# Altium schematic sheet STM_mcu.SchDoc: STM MCU
size A; Date: 10.8.2026; Author: Matevz Sedmak; SheetNumber: 1; SheetTotal: 1
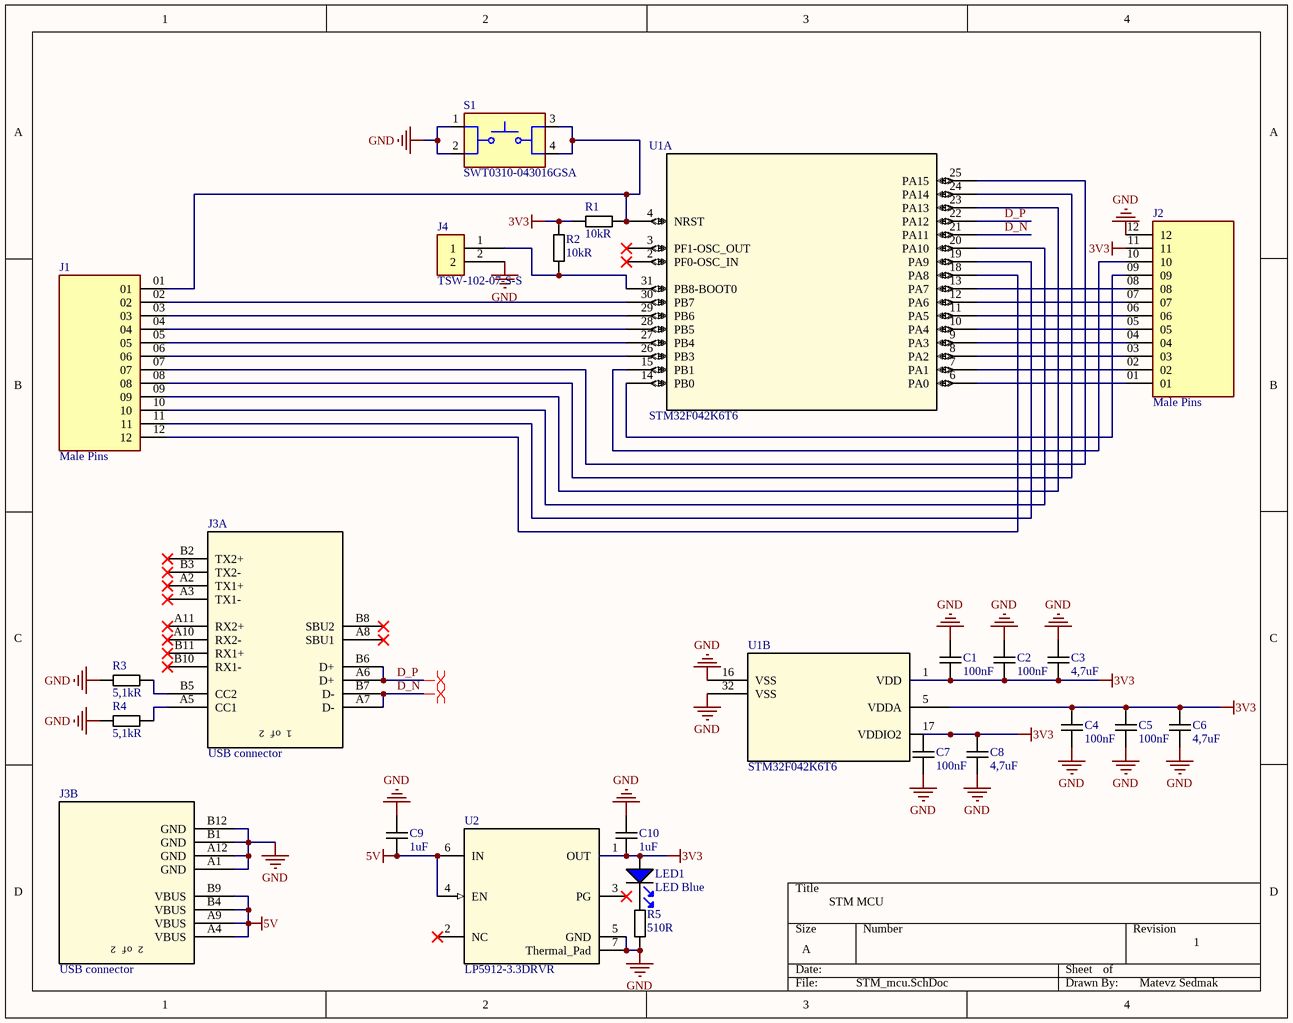
[diagram p0: STM_mcu.SchDoc]

## Parts
C1  100nF  [CAPACITOR_0402]
C2  100nF  [CAPACITOR_0402]
C3  4,7uF  [CAPACITOR_0603]
C4  100nF  [CAPACITOR_0402]
C5  100nF  [CAPACITOR_0402]
C6  4,7uF  [CAPACITOR_0603]
C7  100nF  [CAPACITOR_0402]
C8  4,7uF  [CAPACITOR_0603]
C9  1uF  [CAPACITOR_0603]
C10  1uF  [CAPACITOR_0603]
J1  Male Pins  [SAMTEC_TSW-112-07-L-S]
J2  Male Pins  [SAMTEC_TSW-112-07-L-S]
J3  USB connector  [USB_C_CONN_1054500101]  (parts A,B of 2)
J4  TSW-102-07-S-S  [SAMTEC_TSW-102-07-L-S]
LED1  LED Blue  [LED_0603]
R1  10kR  [RESISTOR_0402]
R2  10kR  [RESISTOR_0402]
R3  5,1kR  [RESISTOR_0402]
R4  5,1kR  [RESISTOR_0402]
R5  510R  [RESISTOR_0402]
S1  SWT0310-043016GSA  [SWT0310 - switch]
U1  STM32F042K6T6  [Quad32-STM32F042K6T6]  (parts A,B of 2)
U2  LP5912-3.3DRVR  [LP5912]

## Nets
3V3: C1.1 C2.1 C3.1 C4.1 C5.1 C6.1 C7.1 C8.1 C10.1 J2.11 LED1.2(A) R1.1(R1) R2.1(R1) U1.1(VDD) U1.5(VDDA) U1.17(VDDIO2) U2.1(OUT)
5V: C9.1 J3.A4(VBUS) J3.A9(VBUS) J3.B4(VBUS) J3.B9(VBUS) U2.4(EN) U2.6(IN)
GND: C1.2 C2.2 C3.2 C4.2 C5.2 C6.2 C7.2 C8.2 C9.2 C10.2 J2.12 J3.A1(GND) J3.A12(GND) J3.B1(GND) J3.B12(GND) J4.2 R3.1(R1) R4.1(R1) R5.1(R1) S1.1 S1.2 U1.16(VSS) U1.32(VSS) U2.5(GND) U2.7(Thermal_Pad)
D_N: J3.A7(D-) J3.B7(D-) U1.21(PA11)
D_P: J3.A6(D+) J3.B6(D+) U1.22(PA12)
NetJ1_01: J1.01 R1.2(R2) S1.3 S1.4 U1.4(NRST)
NetJ1_02: J1.02 U1.30(PB7)
NetJ1_03: J1.03 U1.29(PB6)
NetJ1_04: J1.04 U1.28(PB5)
NetJ1_05: J1.05 U1.27(PB4)
NetJ1_06: J1.06 U1.26(PB3)
NetJ1_07: J1.07 U1.25(PA15)
NetJ1_08: J1.08 U1.24(PA14)
NetJ1_09: J1.09 U1.23(PA13)
NetJ1_10: J1.10 U1.20(PA10)
NetJ1_11: J1.11 U1.19(PA9)
NetJ1_12: J1.12 U1.18(PA8)
NetJ2_01: J2.01 U1.6(PA0)
NetJ2_02: J2.02 U1.7(PA1)
NetJ2_03: J2.03 U1.8(PA2)
NetJ2_04: J2.04 U1.9(PA3)
NetJ2_05: J2.05 U1.10(PA4)
NetJ2_06: J2.06 U1.11(PA5)
NetJ2_07: J2.07 U1.12(PA6)
NetJ2_08: J2.08 U1.13(PA7)
NetJ2_09: J2.09 U1.14(PB0)
NetJ2_10: J2.10 U1.15(PB1)
NetJ3_A5: J3.A5(CC1) R4.2(R2)
NetJ3_B5: J3.B5(CC2) R3.2(R2)
NetJ4_1: J4.1 R2.2(R2) U1.31(PB8-BOOT0)
NetLED1_1: LED1.1(C) R5.2(R2)

Not connected (* = marked no-connect by the designer): J3 A2(TX1+)* A3(TX1-)* A8(SBU1)* A10(RX2-)* A11(RX2+)* B2(TX2+)* B3(TX2-)* B8(SBU2)* B10(RX1-)* B11(RX1+)*; U1 2(PF0-OSC_IN)* 3(PF1-OSC_OUT)*; U2 2(NC)* 3(PG)*

## Layout directives
differential pair: D_N, D_P

## Notes on the sheet
- STM MCU
- 1
- Matevz Sedmak
- (in symbol USB_1054500101, part A) 1 of 2
- (in symbol USB_1054500101, part B) 2 of 2

## Library data of the parts
C1 C2 C4 C5 C7 = 100nF-50V-0402: 0.1 µF ±20% 50V Ceramic Capacitor X5R 0402 (1005 Metric); Part Number: CGA2B3X5R1H104M050BB
C3 C6 C8 = 4,7uF-25V-0603: 4.7 µF ±10% 25V Ceramic Capacitor X5R 0603 (1608 Metric); Part Number: C1608X5R1E475K080AC
C9 C10 = 1uF-25V-0603: 1 µF ±10% 25V Ceramic Capacitor X7R 0603 (1608 Metric); Part Number: CGA3E1X7R1E105K080AC
J1 J2 = TSW-112-07-L-S: Connector Header Through Hole 12 position 0.100" (2.54mm); Part number: TSW-112-07-L-S
J3 = USB_1054500101: Universal Serial Bus (USB) Shielded I/O Receptacle, Type C, Right-Angle, Top Mount, Surface Mount, 0.80mm Solder Tabs, Gold (Au) Flash over 0.76Âµm Palladium Nickel Plating; Part number: 1054500101
J4 = TSW-102-07-S-S: Connector Header Through Hole 2 position 0.100" (2.54mm); Part number: TSW-102-07-S-S
LED1 = LED-Blue-0603: Blue 470nm LED Indication - Discrete 3.2V 0603 (1608 Metric); Part Number: 150060BS75000
R1 R2 = 10kR-1%-0402: 10 kOhms ±1% 0.063W, 1/16W Chip Resistor 0402 (1005 Metric) Thick Film; Part Number: CRCW040210K0FKEDC
R3 R4 = 5,1kR-1%-0402: 5.1 kOhms ±1% 0.063W, 1/16W Chip Resistor 0402 (1005 Metric) Thick Film; Part Number: CRCW04025K10FKEDC
R5 = 510R-1%-0402: 510 Ohms ±1% 0.063W, 1/16W Chip Resistor 0402 (1005 Metric) Automotive AEC-Q200 Thick Film; Part Number: CRCW0402510RFKED
S1 = SWT0310-043016GSA: 6mm x 6mm Gull Wing Tactile Switch; Part number: SWT0310-043016GSA
U1 = STM32F042K6T6: Mainstream Arm Cortex-M0 USB line MCU with 32 Kbytes of Flash memory, 48 MHz CPU, USB, CAN and CEC functions; Part number: STM32F042K6T6
U2 = LP5912-3.3DRVR: 500-mA&nbsp;low-noise&nbsp;low-IQ&nbsp;low-dropout voltage regulator with reverse current protect 6-WSON -40 to 125; Part number: LP5912-3.3DRVR